# EAGLE schematic inverter (EAGLE 6.1)
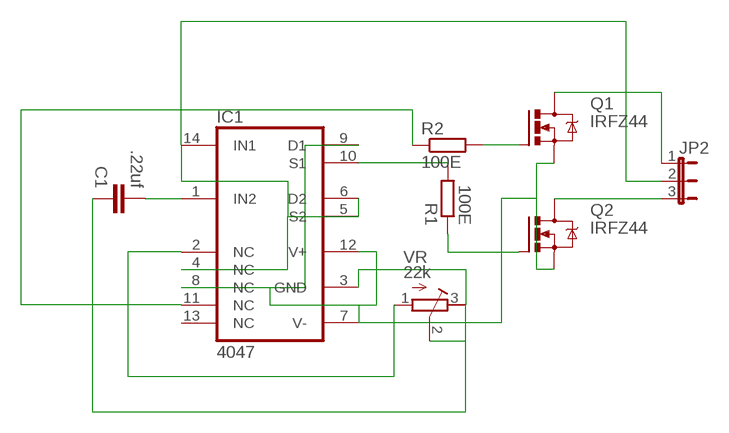
[diagram p0: schematic, sheet 1]

## Parts
C1  .22uf  C2.5/2  [C2.5-2]
IC1  4047  DG200ACJ  [DIL14]
JP2  JP2E  [JP2]
Q1  IRFZ44  IRFZ48Z  [TO220BH]
Q2  IRFZ44  IRFZ48Z  [TO220BH]
R1  100E  R-EU_0204/7  [0204/7]
R2  100E  R-EU_0204/7  [0204/7]
VR  22k  R-TRIMM64P  [RTRIM64P]

## Nets
N$1: IC1.11(NC) R2.1
N$2: Q2.G R1.1
N$3: IC1.10(S1) R1.2
N$4: Q1.G R2.2
N$5: IC1.7(V-) IC1.8(NC) IC1.9(D1) IC1.12(V+) Q1.S Q2.S
N$6: JP2.1 Q1.D
N$7: JP2.3 Q2.D
N$8: IC1.4(NC) IC1.5(S2) IC1.6(D2) IC1.14(IN1) JP2.2
N$10: C1.2 IC1.1(IN2)
N$11: IC1.2(NC) VR.1(E)
N$12: C1.1 IC1.3(GND) VR.2(S) VR.3(A)
Unconnected: IC1.13(NC)

## Library data of the parts
C1 = capacitor-wima:C: CAPACITOR naming: grid - package width
IC1 = maxim:DG200ACJ: ANALOG SWITCH; OC_FARNELL: unknown; OC_NEWARK: 77C6395
JP2 = jumper:JP2E: JUMPER
Q1 Q2 = transistor-power:IRFZ48: N Channel HEXFET® Power MOSFET Logic Level Source: http://www.irf.com/product-info/datasheets/data/irfz48z.pdf
R1 R2 = rcl:R-EU_: RESISTOR, European symbol
VR = resistor:R-TRIMM: Trimm resistor